# Altium schematic sheet Sensor_Shield_V2.SchDoc
size A4
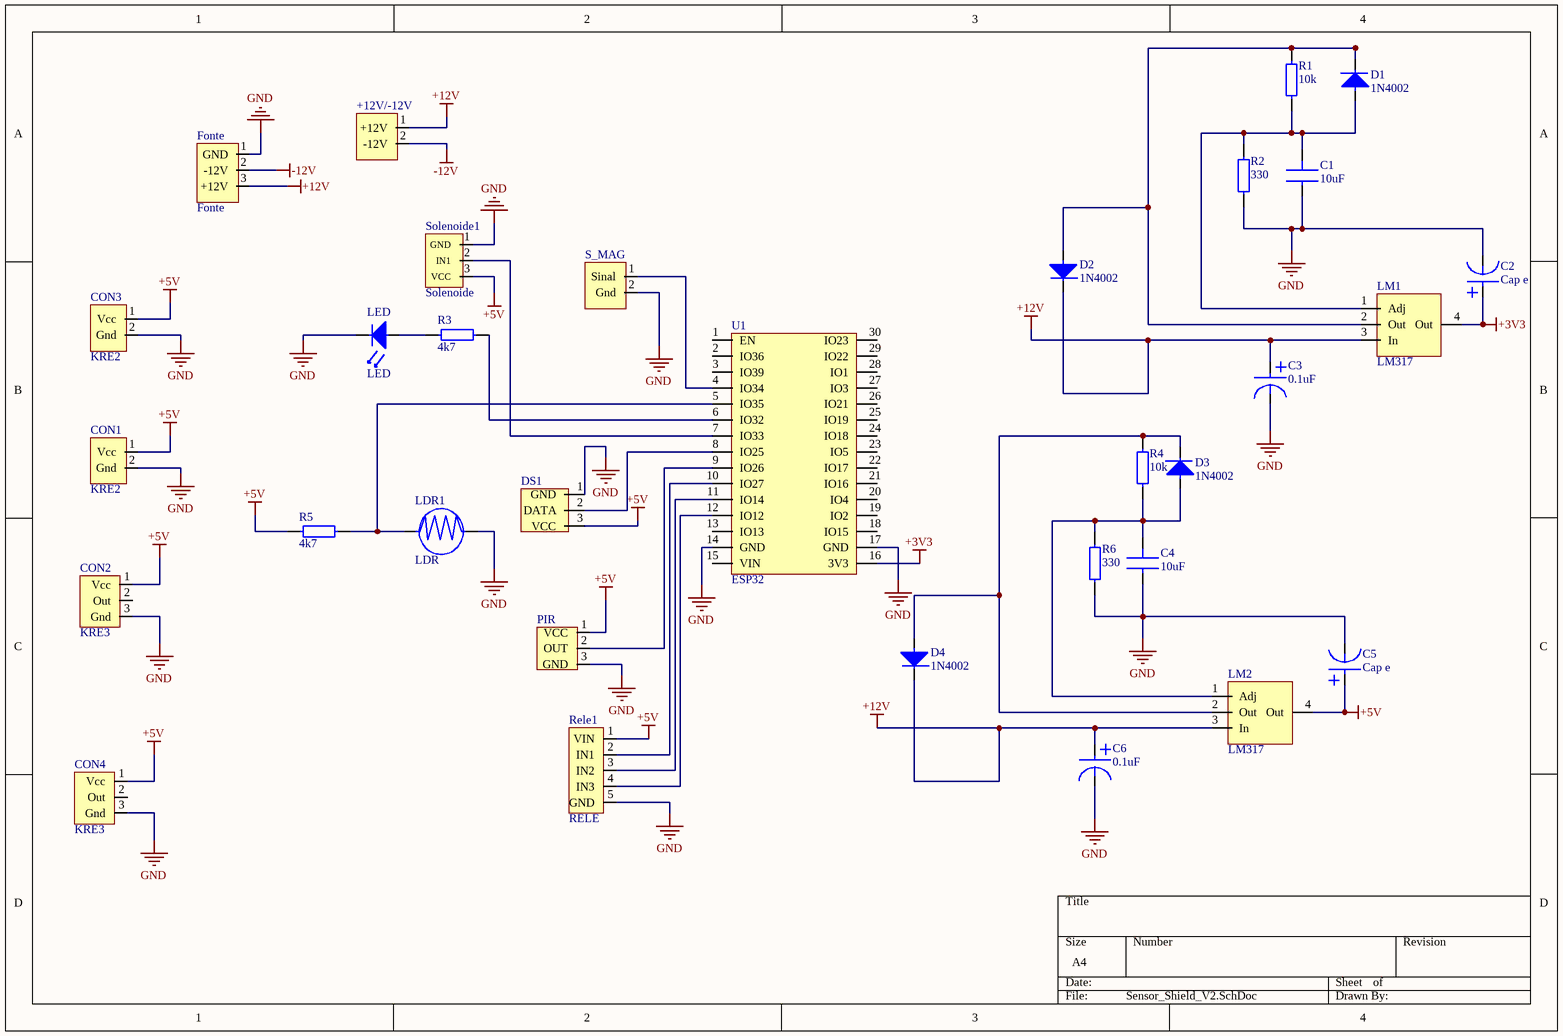
[diagram p0: Sensor_Shield_V2.SchDoc]

## Parts
+12V/-12V  +12V/-12V  [KRE2]  (value not drawn)
C1  10uF  [C_ADJ]
C2  Cap e  [C_Eletrolitico]
C3  0.1uF  [C_Tantalo]
C4  10uF  [C_ADJ]
C5  Cap e  [C_Eletrolitico]
C6  0.1uF  [C_Tantalo]
CON1  KRE2  [KRE2]
CON2  KRE3  [KRE3]
CON3  KRE2  [KRE2]
CON4  KRE3  [KRE3]
D1  1N4002  [Do-214ac]
D2  1N4002  [Do-214ac]
D3  1N4002  [Do-214ac]
D4  1N4002  [Do-214ac]
DS1  Sensor Temperatura  [Ds18b20]  (value not drawn)
Fonte  Fonte  [KRE3]
LDR1  LDR  [LDR]
LED  LED  [R0805]
LM1  LM317  [LM317]
LM2  LM317  [LM317]
PIR  Hc505  [PIR]  (value not drawn)
R1  10k  [R0805]
R2  330  [R0805]
R3  4k7  [R0805]
R4  10k  [R0805]
R5  4k7  [R0805]
R6  330  [R0805]
Rele1  RELE  [CON_5_TERM]
S_MAG  S_MAG  [KRE2]  (value not drawn)
Solenoide1  Solenoide  [KRE3]
U1  ESP32  [MODULO_ESP32]

## Nets
+3V3: C2.1 LM1.4(Out) U1.16(3V3)
+5V: C5.1 CON1.1(Vcc) CON2.1(Vcc) CON3.1(Vcc) CON4.1(Vcc) DS1.3(VCC) LM2.4(Out) PIR.1(VCC) R5.1 Rele1.1(VIN) Solenoide1.3(VCC)
+12V: +12V/-12V.1(+12V) C3.1 C6.1 D2.2 D4.2 Fonte.3(+12V) LM1.3(In) LM2.3(In)
-12V: +12V/-12V.2(-12V) Fonte.2(-12V)
GND: C1.1 C2.2 C3.2 C4.1 C5.2 C6.2 CON1.2(Gnd) CON2.3(Gnd) CON3.2(Gnd) CON4.3(Gnd) DS1.1(GND) Fonte.1(GND) LDR1.2 LED.2(K) PIR.3(GND) R2.1 R6.1 Rele1.5(GND) S_MAG.2(Gnd) Solenoide1.1(GND) U1.14(GND) U1.17(GND)
NetC1_2: C1.2 D1.1 LM1.1(Adj) R1.1 R2.2
NetC4_2: C4.2 D3.1 LM2.1(Adj) R4.1 R6.2
NetD1_2: D1.2 D2.1 LM1.2(Out) R1.2
NetD3_2: D3.2 D4.1 LM2.2(Out) R4.2
NetDS1_2: DS1.2(DATA) U1.8(IO25)
NetLDR1_1: LDR1.1 R5.2 U1.5(IO35)
NetLED_1: LED.1(A) R3.1
NetPIR_2: PIR.2(OUT) U1.9(IO26)
NetR3_2: R3.2 U1.6(IO32)
NetRele1_2: Rele1.2(IN1) U1.10(IO27)
NetRele1_3: Rele1.3(IN2) U1.11(IO14)
NetRele1_4: Rele1.4(IN3) U1.12(IO12)
NetS_MAG_1: S_MAG.1(Sinal) U1.4(IO34)
NetSolenoide1_2: Solenoide1.2(IN1) U1.7(IO33)

Not connected (* = marked no-connect by the designer): CON2 2(Out); CON4 2(Out); U1 1(EN) 2(IO36) 3(IO39) 13(IO13) 15(VIN) 18(IO15) 19(IO2) 20(IO4) 21(IO16) 22(IO17) 23(IO5) 24(IO18) 25(IO19) 26(IO21) 27(IO3) 28(IO1) 29(IO22) 30(IO23)

## Library data of the parts
C1 C4 = C10uF: C adj
C2 C5 = C1.0uF
C3 C6 = C0.1uF: Cap Tantalo
D1-D4 = 1N4002_smd: Diodo
DS1 = Ds18b20
PIR = PIR505
R1 R4 = R10k: R0805
R2 R6 = R330: R0805
R3 R5 = R4k7: R0805
Rele1 = Relê